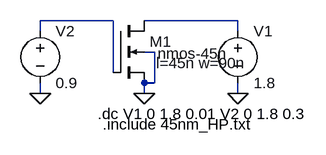
[diagram p0: schematic MOSFET - II.asc]
MOSFET - II.asc, the LTspice schematic file:
Version 4
SHEET 1 880 680
WIRE 128 96 16 96
WIRE 320 96 176 96
WIRE 16 112 16 96
WIRE 320 112 320 96
WIRE 192 144 176 144
WIRE 128 176 128 96
WIRE 192 192 192 144
WIRE 192 192 176 192
WIRE 16 208 16 192
WIRE 176 208 176 192
WIRE 320 208 320 192
FLAG 16 208 0
FLAG 176 208 0
FLAG 320 208 0
SYMBOL nmos4 128 96 R0
WINDOW 3 69 51 Left 2
WINDOW 123 66 65 Left 2
SYMATTR Value nmos-45n
SYMATTR Value2 l=45n w=90n
SYMATTR InstName M1
SYMBOL voltage 320 96 R0
WINDOW 123 0 0 Left 2
WINDOW 39 0 0 Left 2
SYMATTR InstName V1
SYMATTR Value 1.8
SYMBOL voltage 16 96 R0
WINDOW 123 0 0 Left 2
WINDOW 39 0 0 Left 2
SYMATTR InstName V2
SYMATTR Value 0.9
TEXT 112 256 Left 2 !.include 45nm_HP.txt
TEXT 104 240 Left 2 !.dc V1 0 1.8 0.01 V2 0 1.8 0.3

The netlist it stands for:
* MOSFET - II.asc
M1 N002 N001 0 0 nmos-45n l=45n w=90n
V1 N002 0 1.8
V2 N001 0 0.9
.model NMOS NMOS
.model PMOS PMOS
.lib standard.mos
.include 45nm_HP.txt
.dc V1 0 1.8 0.01 V2 0 1.8 0.3
.backanno
.end